# Altium schematic sheet Sheet2.SchDoc
size A4
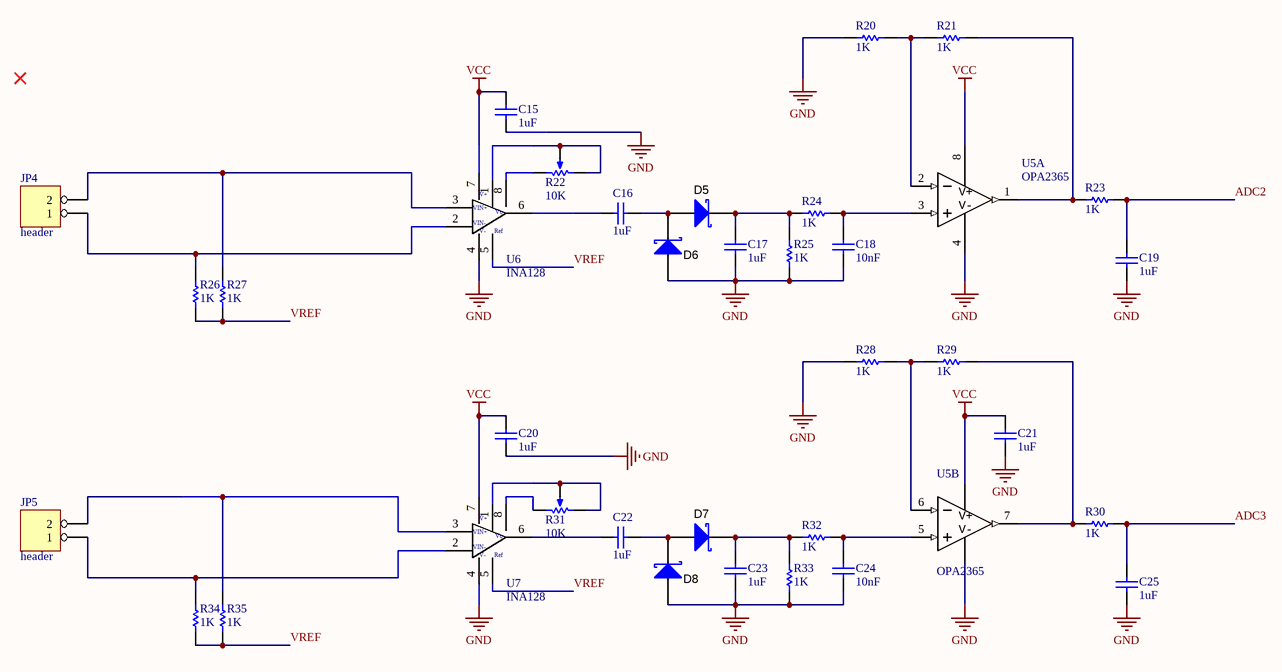
[diagram p0: Sheet2.SchDoc]

## Parts
C15  1uF  [0603_C]
C16  1uF  [0603_C]
C17  1uF  [0603_C]
C18  10nF  [0603_C]
C19  1uF  [0603_C]
C20  1uF  [0603_C]
C21  1uF  [0603_C]
C22  1uF  [0603_C]
C23  1uF  [0603_C]
C24  10nF  [0603_C]
C25  1uF  [0603_C]
D5  Diode, Schottky  [SOD323]  (value not drawn)
D6  Diode, Schottky  [SOD323]  (value not drawn)
D7  Diode, Schottky  [SOD323]  (value not drawn)
D8  Diode, Schottky  [SOD323]  (value not drawn)
JP4  header  [header2]
JP5  header  [header2]
R20  1K  [R0603]
R21  1K  [R0603]
R22  10K  [3224W]
R23  1K  [R0603]
R24  1K  [R0603]
R25  1K  [R0603]
R26  1K  [R0603]
R27  1K  [R0603]
R28  1K  [R0603]
R29  1K  [R0603]
R30  1K  [R0603]
R31  10K  [3224W]
R32  1K  [R0603]
R33  1K  [R0603]
R34  1K  [R0603]
R35  1K  [R0603]
U5  OPA2365  [SOP8]  (parts A,B of 2)
U6  INA128  [SOIC-8]
U7  INA128  [SOIC-8]

## Nets
GND: C15.1 C17.1 C18.1 C19.1 C20.1 C21.1 C23.1 C24.1 C25.1 D6.2(A) D8.2(A) R20.2 R25.1 R28.2 R33.1 U5.4(V-) U6.4(V-) U7.4(V-)
VCC: C15.2 C20.2 C21.2 U5.8(V+) U6.7(V+) U7.7(V+)
ADC2: C19.2 R23.1
ADC3: C25.2 R30.1
VREF: R26.1 R27.1 R34.1 R35.1 U6.5(Ref) U7.5(Ref)
NetC16_1: C16.1 D5.2(A) D6.1(K)
NetC16_2: C16.2 U6.6(Vo)
NetC17_2: C17.2 D5.1(K) R24.2 R25.2
NetC18_2: C18.2 R24.1 U5.3(1IN+)
NetC22_1: C22.1 D7.2(A) D8.1(K)
NetC22_2: C22.2 U7.6(Vo)
NetC23_2: C23.2 D7.1(K) R32.2 R33.2
NetC24_2: C24.2 R32.1 U5.5(2IN+)
NetJP4_1: JP4.1 R26.2 U6.2(VIN-)
NetJP4_2: JP4.2 R27.2 U6.3(VIN+)
NetJP5_1: JP5.1 R34.2 U7.2(VIN-)
NetJP5_2: JP5.2 R35.2 U7.3(VIN+)
NetR20_1: R20.1 R21.2 U5.2(1IN-)
NetR21_1: R21.1 R23.2 U5.1(1OUT)
NetR22_1: R22.1(BOT) R22.2(TAP) U6.1
NetR22_3: R22.3(TOP) U6.8
NetR28_1: R28.1 R29.2 U5.6(2IN-)
NetR29_1: R29.1 R30.2 U5.7(2OUT)
NetR31_1: R31.1(BOT) R31.2(TAP) U7.1
NetR31_3: R31.3(TOP) U7.8

## Library data of the parts
C15-C25 = CAP: Capacitor; Value: 104; Published: 8-Jun-2000; LatestRevisionDate: 17-Jul-2002; LatestRevisionNote: Re-released for DXP Platform.; PackageReference: RAD-0.3; Publisher: Altium Limited
D5-D8 = D_Schottky: Diode, Schottky, 40 V, 0.2 A, DO-213AC; Manufacturer: Vishay-Semiconductor; PartNumber: LL103A-GS08; U/M: EA; Vf_V: 0.6; Value: 40V; Value1: 0.2A; Value2: 0.6V; Io_A: 0.2; Vr_V: 40; TJmax_C: 125; AEC Category: Q101; SymbolVersion: 2008-12-08; MountType: SMT; RoHS: Y; PackageReference: DO-213AC; ComponentLink1Description: Datasheet link; ComponentLink1URL: http://www.diodes.com/datasheets/ds30258.pdf; CompType: Diode; Type: Schottky; Published: 2008-06-26; Publisher: Texas Instruments; LatestRevisionDate: 2016-03-10; Supplier 1: Digi-Key; Supplier Part Number 1: LL103A-GS08CT-ND; Supplier 2: Mouser; Supplier Part Number 2: 625-LL103A; Supplier 3: Farnell; Supplier Part Number 3: 1469389; AEC Qualified: ?
JP4 JP5 = HEADER 2
R20 R21 R23-R30 R32-R35 = RES: Resistor; Published: 8-Jun-2000; Revision: July-2002: Re-released for DXP Platform.; Publisher: Altium Limited; Value: 1K
R22 R31 = 单联电位器
U5 = OPA2365: Imported; Manufacturer: Texas Instruments; Manufacturer_Part_Number: opa2365_d_8; INDUSTRY_STD_PKG_TYPE: SOIC; FAMILY_NAME: LOW OFFSET VOLTAGE; PIN_COUNT: 8; PACKAGE_DESIGNATOR: D; Datasheet URL: http://www.ti.com/lit/gpn/OPA2365; GENERIC_PART_NUMBER: OPA2365; Vendor: Texas Instruments; RefDes: RefDes; Type: DEV; Value: Value
U6 U7 = INA118